# EAGLE design Mixer-01 (EAGLE 6.6.0)
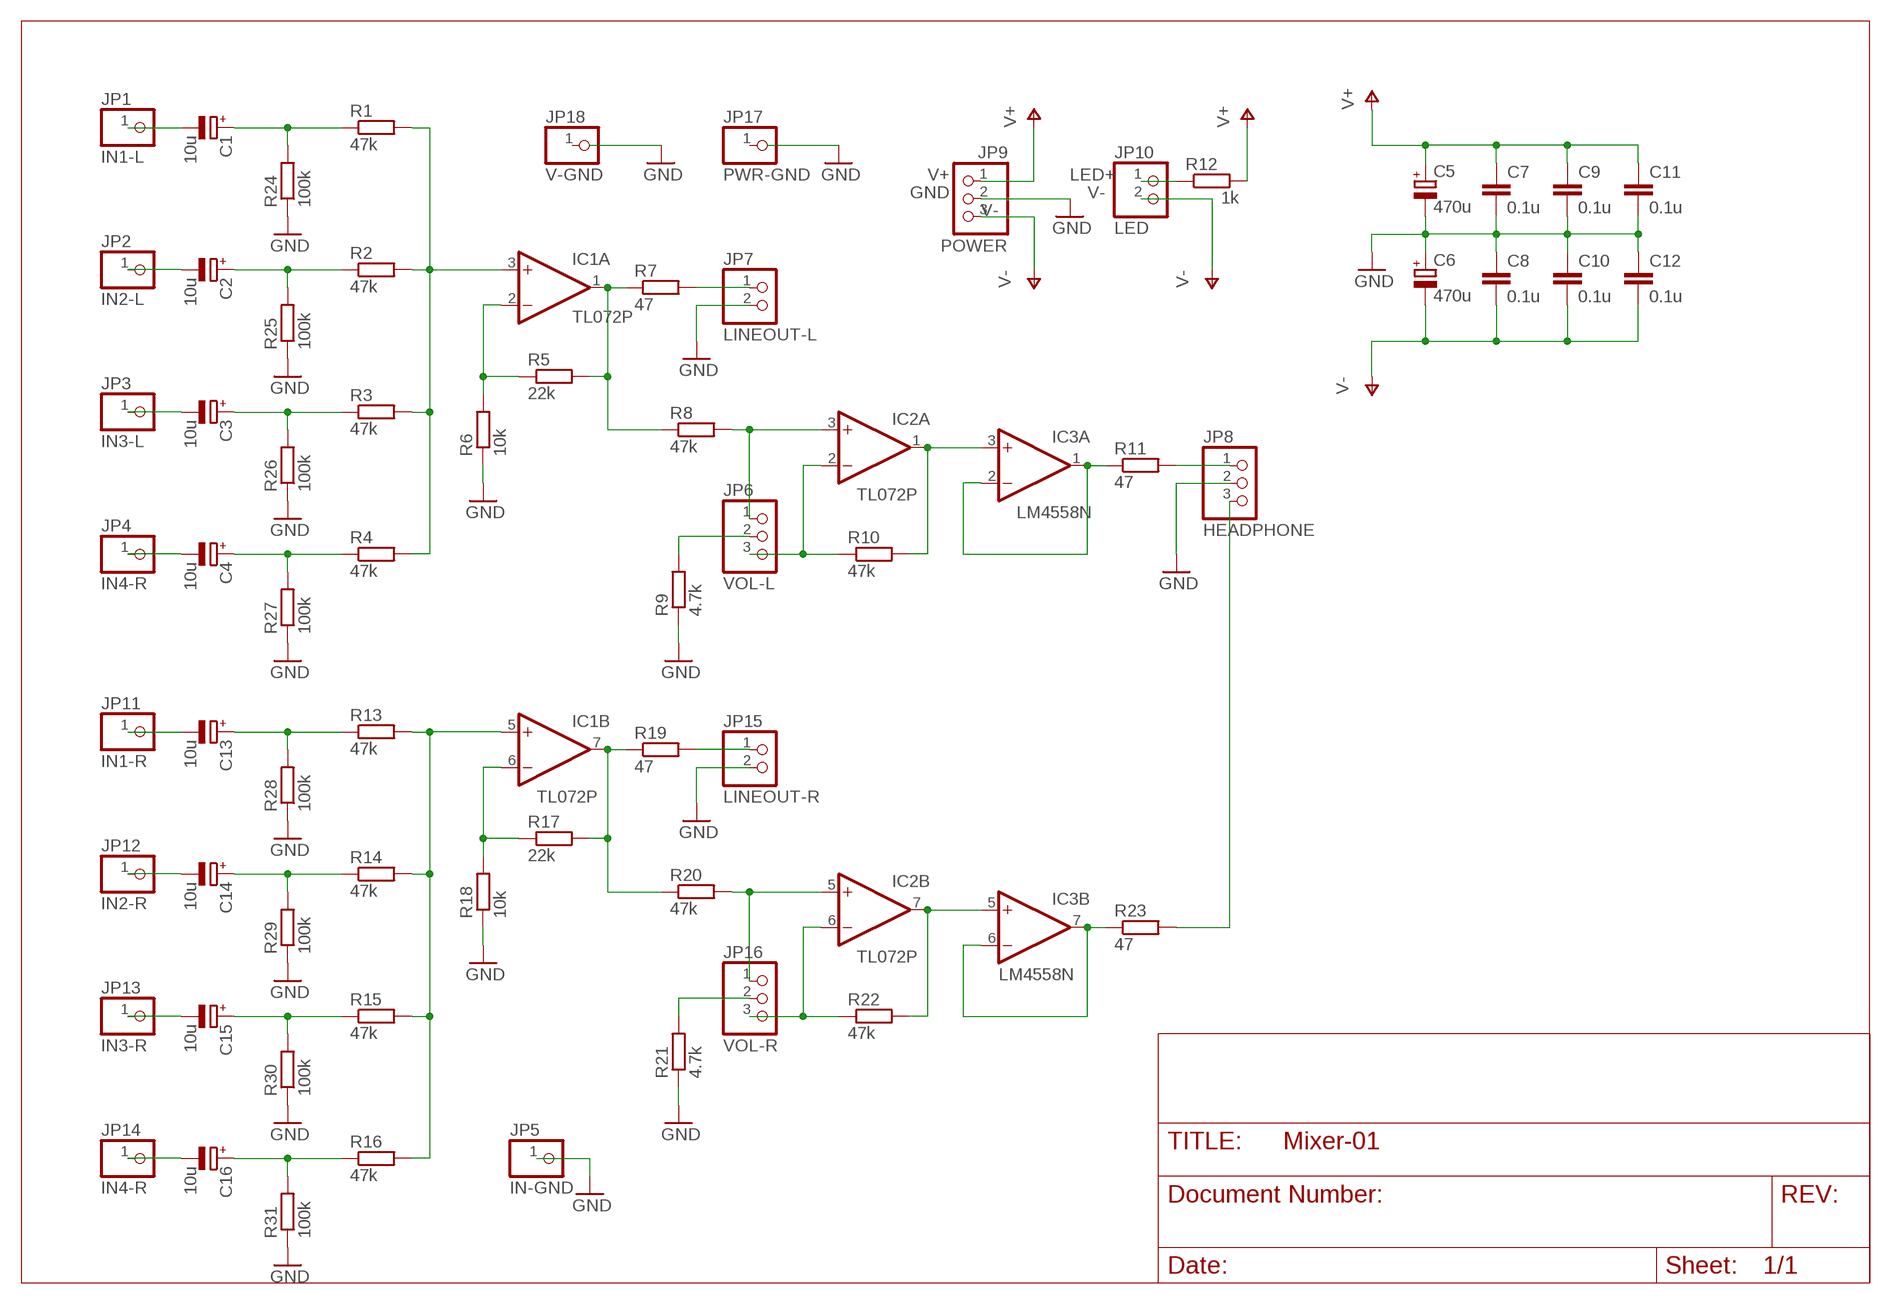
[diagram p0: schematic, sheet 1]

## Parts
C1  10u  CPOL-EUE5-8.5  [E5-8,5]
C2  10u  CPOL-EUE5-8.5  [E5-8,5]
C3  10u  CPOL-EUE5-8.5  [E5-8,5]
C4  10u  CPOL-EUE5-8.5  [E5-8,5]
C5  470u  CPOL-EUE7.5-16  [E7,5-16]
C6  470u  CPOL-EUE7.5-16  [E7,5-16]
C7  0.1u  C-EU050-024X044  [C050-024X044]
C8  0.1u  C-EU050-024X044  [C050-024X044]
C9  0.1u  C-EU050-024X044  [C050-024X044]
C10  0.1u  C-EU050-024X044  [C050-024X044]
C11  0.1u  C-EU050-024X044  [C050-024X044]
C12  0.1u  C-EU050-024X044  [C050-024X044]
C13  10u  CPOL-EUE5-8.5  [E5-8,5]
C14  10u  CPOL-EUE5-8.5  [E5-8,5]
C15  10u  CPOL-EUE5-8.5  [E5-8,5]
C16  10u  CPOL-EUE5-8.5  [E5-8,5]
IC1  TL072P  [DIL08]
IC2  TL072P  [DIL08]
IC3  LM4558N  [DIL08]
JP1  IN1-L  PINHD-1X1  [1X01]
JP2  IN2-L  PINHD-1X1  [1X01]
JP3  IN3-L  PINHD-1X1  [1X01]
JP4  IN4-R  PINHD-1X1  [1X01]
JP5  IN-GND  PINHD-1X1  [1X01]
JP6  VOL-L  PINHD-1X3  [1X03]
JP7  LINEOUT-L  PINHD-1X2  [1X02]
JP8  HEADPHONE  PINHD-1X3  [1X03]
JP9  POWER  PINHD-1X3  [1X03]
JP10  LED  PINHD-1X2  [1X02]
JP11  IN1-R  PINHD-1X1  [1X01]
JP12  IN2-R  PINHD-1X1  [1X01]
JP13  IN3-R  PINHD-1X1  [1X01]
JP14  IN4-R  PINHD-1X1  [1X01]
JP15  LINEOUT-R  PINHD-1X2  [1X02]
JP16  VOL-R  PINHD-1X3  [1X03]
JP17  PWR-GND  PINHD-1X1  [1X01]
JP18  V-GND  PINHD-1X1  [1X01]
R1  47k  R-EU_0207/7  [0207/7]
R2  47k  R-EU_0207/7  [0207/7]
R3  47k  R-EU_0207/7  [0207/7]
R4  47k  R-EU_0207/7  [0207/7]
R5  22k  R-EU_0207/7  [0207/7]
R6  10k  R-EU_0207/7  [0207/7]
R7  47  R-EU_0207/7  [0207/7]
R8  47k  R-EU_0207/7  [0207/7]
R9  4.7k  R-EU_0207/7  [0207/7]
R10  47k  R-EU_0207/7  [0207/7]
R11  47  R-EU_0207/7  [0207/7]
R12  1k  R-EU_0207/7  [0207/7]
R13  47k  R-EU_0207/7  [0207/7]
R14  47k  R-EU_0207/7  [0207/7]
R15  47k  R-EU_0207/7  [0207/7]
R16  47k  R-EU_0207/7  [0207/7]
R17  22k  R-EU_0207/7  [0207/7]
R18  10k  R-EU_0207/7  [0207/7]
R19  47  R-EU_0207/7  [0207/7]
R20  47k  R-EU_0207/7  [0207/7]
R21  4.7k  R-EU_0207/7  [0207/7]
R22  47k  R-EU_0207/7  [0207/7]
R23  47  R-EU_0207/7  [0207/7]
R24  100k  R-EU_0207/7  [0207/7]
R25  100k  R-EU_0207/7  [0207/7]
R26  100k  R-EU_0207/7  [0207/7]
R27  100k  R-EU_0207/7  [0207/7]
R28  100k  R-EU_0207/7  [0207/7]
R29  100k  R-EU_0207/7  [0207/7]
R30  100k  R-EU_0207/7  [0207/7]
R31  100k  R-EU_0207/7  [0207/7]

## Nets
GND: C5.- C6.+ C7.2 C8.1 C9.2 C10.1 C11.2 C12.1 JP5.1 JP7.2 JP8.2 JP9.2 JP15.2 R6.1 R9.1 R18.1 R21.1 R24.1 R25.1 R26.1 R27.1 R28.1 R29.1 R30.1 R31.1
LED+: JP10.1 R12.1
N$1: C1.- JP1.1
N$2: C2.- JP2.1
N$3: C3.- JP3.1
N$4: C4.- JP4.1
N$6: JP6.2 R9.2
N$7: C13.+ R13.1 R28.2
N$8: C14.+ R14.1 R29.2
N$9: C1.+ R1.1 R24.2
N$10: C2.+ R2.1 R25.2
N$11: C3.+ R3.1 R26.2
N$12: C4.+ R4.1 R27.2
N$13: IC1.3(A:+IN) R1.2 R2.2 R3.2 R4.2
N$14: IC1.2(A:-IN) R5.1 R6.2
N$15: IC1.1(A:OUT) R5.2 R7.1 R8.1
N$16: JP7.1 R7.2
N$17: IC2.3(A:+IN) JP6.1 R8.2
N$18: C15.+ R15.1 R30.2
N$19: IC2.2(A:-IN) JP6.3 R10.1
N$20: IC2.1(A:OUT) IC3.3(A:+IN) R10.2
N$21: IC3.1(A:OUT) IC3.2(A:-IN) R11.1
N$22: JP8.1 R11.2
N$23: C16.+ R16.1 R31.2
N$24: IC1.5(B:+IN) R13.2 R14.2 R15.2 R16.2
N$25: IC1.6(B:-IN) R17.1 R18.2
N$26: IC1.7(B:OUT) R17.2 R19.1 R20.1
N$27: JP15.1 R19.2
N$28: IC2.5(B:+IN) JP16.1 R20.2
N$29: IC2.6(B:-IN) JP16.3 R22.1
N$30: IC2.7(B:OUT) IC3.5(B:+IN) R22.2
N$31: IC3.6(B:-IN) IC3.7(B:OUT) R23.1
N$32: JP8.3 R23.2
N$33: C13.- JP11.1
N$34: C14.- JP12.1
N$35: C15.- JP13.1
N$36: C16.- JP14.1
N$37: JP16.2 R21.2
V+: C5.+ C7.1 C9.1 C11.1 JP9.1 R12.2
V-: C6.- C8.2 C10.2 C12.2 JP9.3 JP10.2
Unconnected: JP17.1 JP18.1

## Power pins joined to a net without a drawn wire
V+: IC1.8(P:V+) IC2.8(P:V+) IC3.8(P:V+)
V-: IC1.4(P:V-) IC2.4(P:V-) IC3.4(P:V-)

## Library data of the parts
C1-C6 C13-C16 = rcl:CPOL-EU: POLARIZED CAPACITOR, European symbol
C7-C12 = resistor:C-EU: CAPACITOR, European symbol
IC1 IC2 = linear:TL072: OP AMP
IC3 = linear:*4558: OP AMP
JP1-JP5 JP11-JP14 JP17 JP18 = pinhead:PINHD-1X1: PIN HEADER
JP6 JP8 JP9 JP16 = pinhead:PINHD-1X3: PIN HEADER
JP7 JP10 JP15 = pinhead:PINHD-1X2: PIN HEADER
R1-R23 = resistor:R-EU_: RESISTOR, European symbol
R24-R31 = rcl:R-EU_: RESISTOR, European symbol

## Board
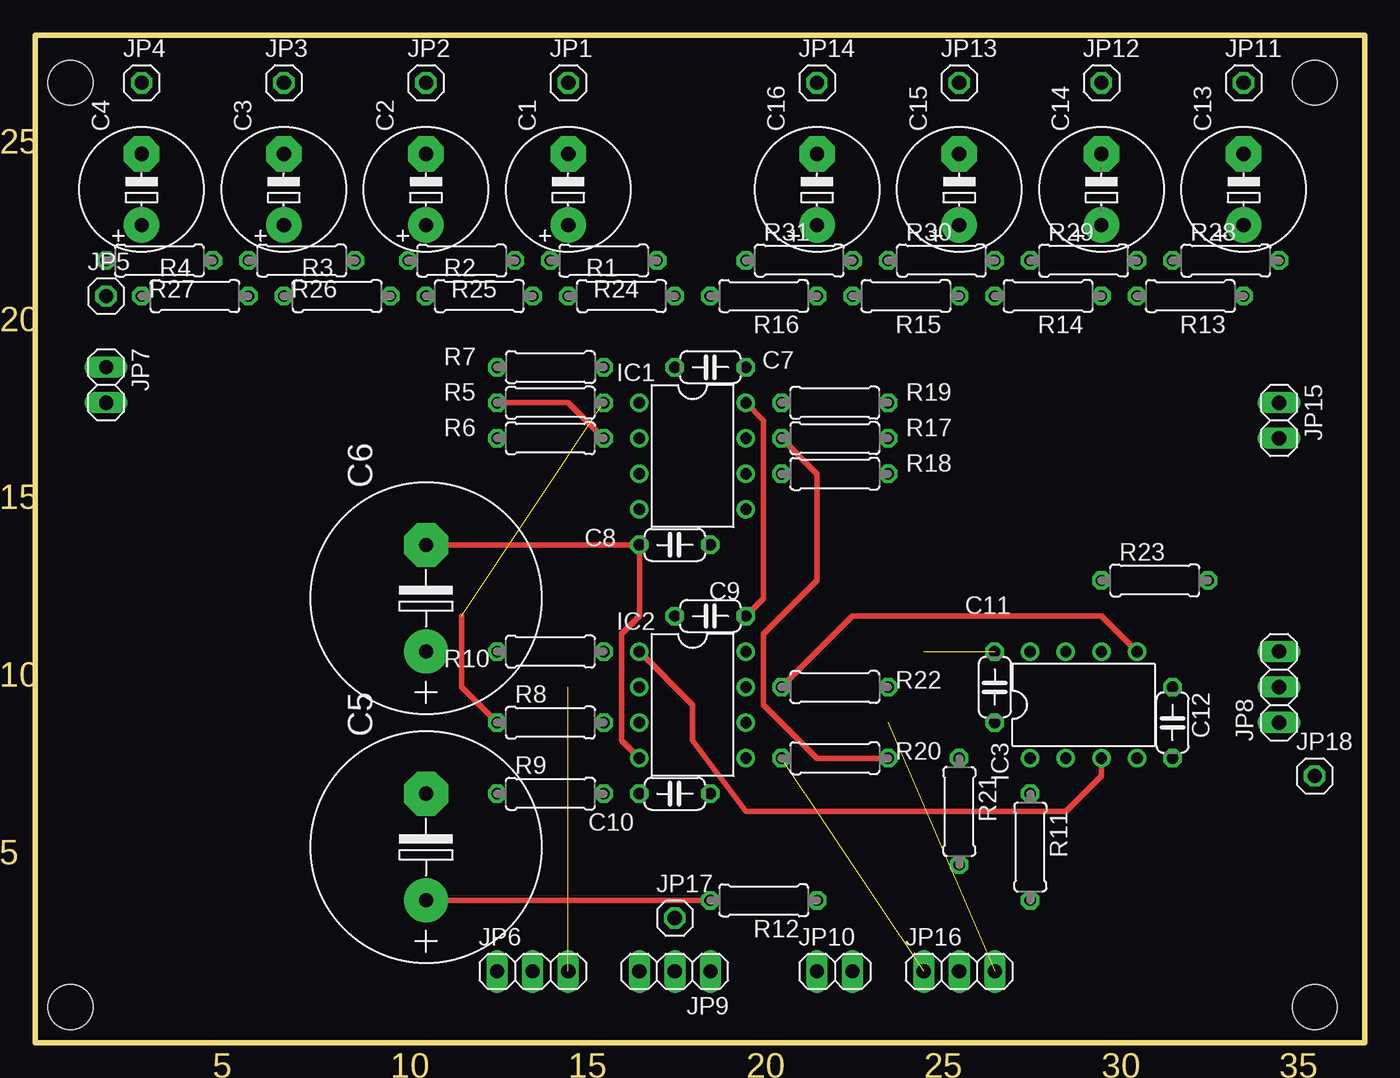
[diagram p1: board, top side]
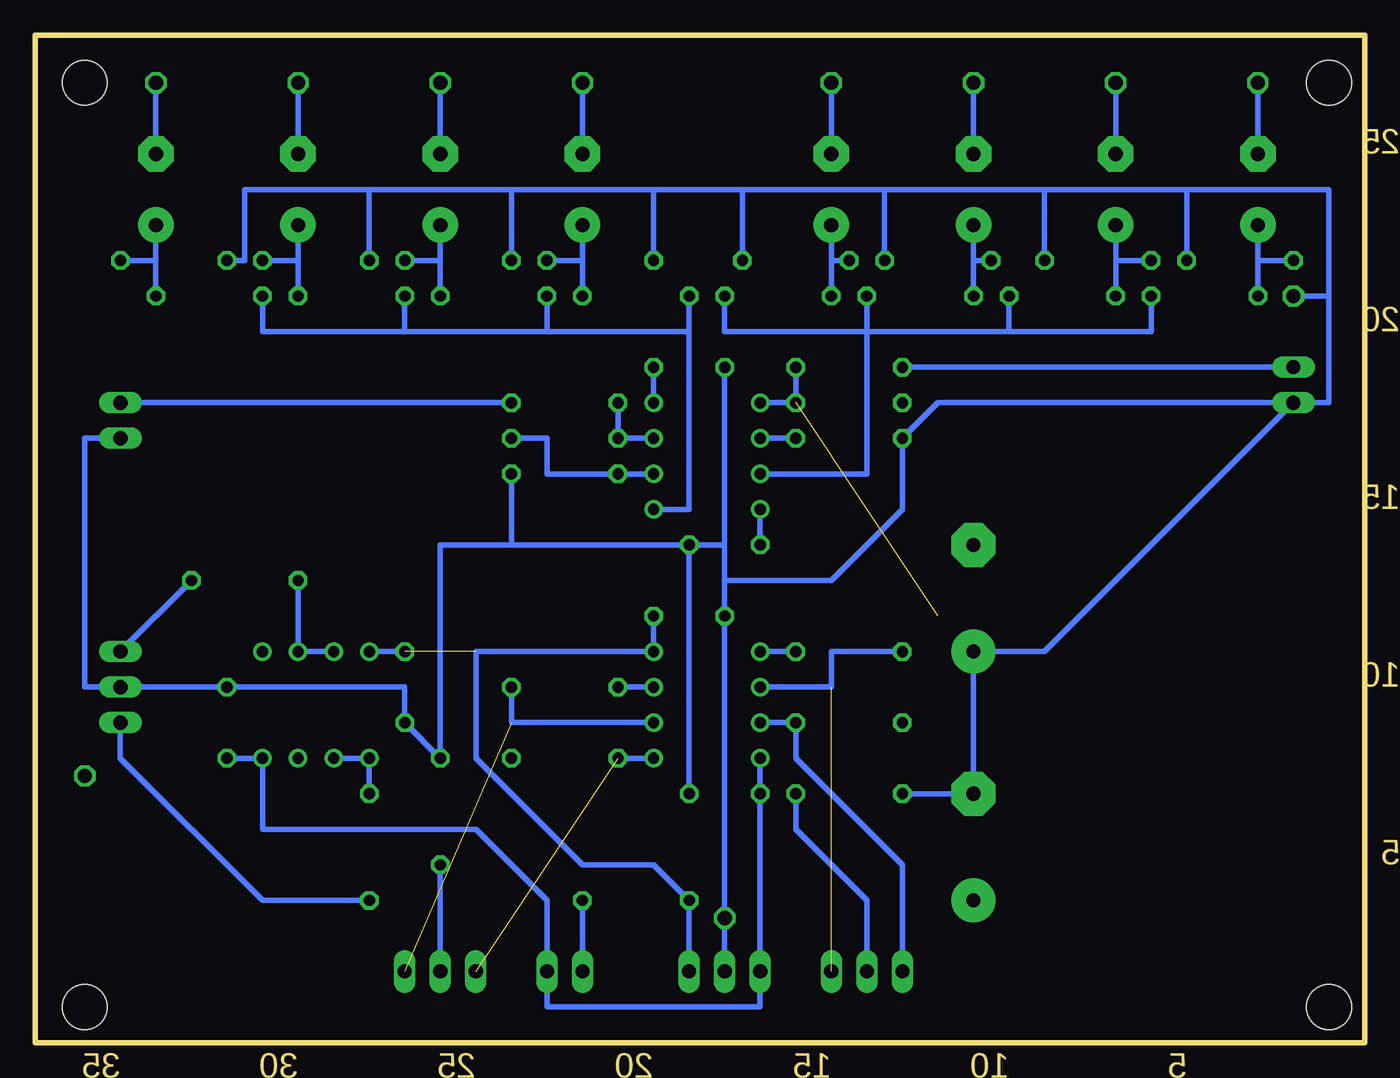
[diagram p2: board, bottom side, seen from below]

Size 95 x 72 mm. Coordinates in mm from the lower left corner, seen from the top.
Outline: 0,0 0,72 95,72 95,0 0,0
Copper layers (1*16): Top 0.035mm / dielectric 1.5mm / Bottom 0.035mm
Design rules "default": minimum track width 10mil, minimum drill 24mil, track to track 8mil, track to pad 8mil, pad to pad 8mil, via to via 8mil, smd to smd 8mil, copper to edge 40mil, drill to drill 8mil, minimum pad ring 10mil, minimum via ring 8mil, stop-mask expansion 4mil, vias tented up to drill 0mil, thermal gap 10mil
Holes 3.2 mm at 2.54,68.58 2.54,2.54 91.44,2.54 91.44,68.58

### Footprints (pad centres in the part's own frame; a part is rotated, then mirrored left to right if it is on the bottom)
E5-8,5 = drill 1.016 pad 2.54: + -2.54,0 | drill 1.016 pad 2.54 octagon: - 2.54,0
E7,5-16 = drill 1.016 pad 3.15: + -3.81,0 | drill 1.016 pad 3.15 octagon: - 3.81,0
C050-024X044 = drill 0.813 octagon: 1 -2.54,0; 2 2.54,0
DIL08 = drill 0.813 pad 1.27: 1 -3.81,-3.81; 2 -1.27,-3.81; 3 1.27,-3.81; 4 3.81,-3.81; 5 3.81,3.81; 6 1.27,3.81; 7 -1.27,3.81; 8 -3.81,3.81
1X01 = drill 1.016 octagon: 1 0,0
1X03 = drill 1.016 long: 1 -2.54,0; 2 0,0; 3 2.54,0
1X02 = drill 1.016 long: 1 -1.27,0; 2 1.27,0
0207/7 = drill 0.813 octagon: 1 -3.81,0; 2 3.81,0

### Placement (x,y rotation side)
C1  38.1,60.96 90 top
C2  27.94,60.96 90 top
C3  17.78,60.96 90 top
C4  7.62,60.96 90 top
C5  27.94,13.97 90 top
C6  27.94,31.75 90 top
C7  48.26,48.26 180 top
C8  45.72,35.56 180 top
C9  48.26,30.48 180 top
C10  45.72,17.78 180 top
C11  68.58,25.4 270 top
C12  81.28,22.86 270 top
C13  86.36,60.96 90 top
C14  76.2,60.96 90 top
C15  66.04,60.96 90 top
C16  55.88,60.96 90 top
IC1  46.99,41.91 270 top
IC2  46.99,24.13 270 top
IC3  74.93,24.13 0 top
JP1  38.1,68.58 0 top
JP2  27.94,68.58 0 top
JP3  17.78,68.58 0 top
JP4  7.62,68.58 0 top
JP5  5.08,53.34 0 top
JP6  35.56,5.08 0 top
JP7  5.08,46.99 270 top
JP8  88.9,25.4 90 top
JP9  45.72,5.08 180 top
JP10  57.15,5.08 0 top
JP11  86.36,68.58 0 top
JP12  76.2,68.58 0 top
JP13  66.04,68.58 0 top
JP14  55.88,68.58 0 top
JP15  88.9,44.45 270 top
JP16  66.04,5.08 0 top
JP17  45.72,8.89 0 top
JP18  91.44,19.05 0 top
R1  41.91,53.34 0 top
R2  31.75,53.34 0 top
R3  21.59,53.34 0 top
R4  11.43,53.34 0 top
R5  36.83,45.72 0 top
R6  36.83,43.18 0 top
R7  36.83,48.26 180 top
R8  36.83,22.86 0 top
R9  36.83,17.78 0 top
R10  36.83,27.94 0 top
R11  71.12,13.97 270 top
R12  52.07,10.16 180 top
R13  82.55,53.34 180 top
R14  72.39,53.34 180 top
R15  62.23,53.34 180 top
R16  52.07,53.34 180 top
R17  57.15,43.18 180 top
R18  57.15,40.64 180 top
R19  57.15,45.72 0 top
R20  57.15,20.32 180 top
R21  66.04,16.51 270 top
R22  57.15,25.4 180 top
R23  80.01,33.02 0 top
R24  40.64,55.88 180 top
R25  30.48,55.88 180 top
R26  19.05,55.88 180 top
R27  8.89,55.88 180 top
R28  85.09,55.88 0 top
R29  74.93,55.88 0 top
R30  64.77,55.88 0 top
R31  54.61,55.88 0 top

### Tracks (layer width: path | path; a pad name or v marks a point on that pad's centre or on a via)
GND
  Bottom 0.406: C7.2 45.72,35.56 | C8.1 C10.1 | JP9.2 C9.2 45.72,33.02 | 60.96,35.56 66.04,35.56 R21.1 C11.2 68.58,25.4 C12.1 JP8.2 91.44,25.4 91.44,43.18 JP15.2 | 60.96,35.56 C8.1 | R18.1 60.96,35.56 | R9.1 C5.- C6.+ 22.86,27.94 JP7.2 | 45.72,33.02 45.72,35.56 | C8.1 45.72,35.56 | 2.54,53.34 2.54,45.72 JP7.2 | 10.16,45.72 JP7.2 | JP7.2 30.48,45.72 R6.1 33.02,38.1 38.1,33.02 45.72,33.02 | JP5.1 2.54,53.34 | 2.54,53.34 2.54,60.96 12.7,60.96 | 12.7,60.96 R27.1 | R26.1 22.86,60.96 | 22.86,60.96 12.7,60.96 | R25.1 34.29,60.96 | 34.29,60.96 22.86,60.96 | R24.1 44.45,60.96 | 44.45,60.96 34.29,60.96 | R31.1 50.8,60.96 | 50.8,60.96 44.45,60.96 | R30.1 60.96,60.96 | 60.96,60.96 50.8,60.96 | R28.1 80.01,55.88 80.01,60.96 71.12,60.96 | 71.12,60.96 60.96,60.96 | R29.1 71.12,60.96
LED+
  Bottom 0.406: R12.1 JP10.1
N$1
  Bottom 0.406: C1.- JP1.1
N$2
  Bottom 0.406: C2.- JP2.1
N$3
  Bottom 0.406: C3.- JP3.1
N$4
  Bottom 0.406: C4.- JP4.1
N$6
  Bottom 0.406: R9.2 40.64,15.24 35.56,10.16 JP6.2
N$7
  Bottom 0.406: C13.+ 86.36,55.88 | 86.36,55.88 R13.1 | R28.2 86.36,55.88
N$8
  Bottom 0.406: R14.1 76.2,55.88 | 76.2,55.88 C14.+ | R29.2 76.2,55.88
N$9
  Bottom 0.406: C1.+ 38.1,55.88 | 38.1,55.88 R1.1 | R24.2 38.1,55.88
N$10
  Bottom 0.406: C2.+ 27.94,55.88 | 27.94,55.88 R2.1 | R25.2 27.94,55.88
N$11
  Bottom 0.406: C3.+ 17.78,55.88 | 17.78,55.88 R3.1 | R26.2 17.78,55.88
N$12
  Bottom 0.406: C4.+ 7.62,55.88 | 7.62,55.88 R4.1 | R27.2 7.62,55.88
N$13
  Bottom 0.406: IC1.3 35.56,40.64 35.56,50.8 | R4.2 15.24,50.8 25.4,50.8 | 25.4,50.8 35.56,50.8 | R3.2 25.4,50.8 | R2.2 35.56,50.8 | 35.56,50.8 45.72,50.8 R1.2
N$14
  Top 0.406: R5.1 38.1,45.72 R6.2
  Bottom 0.406: IC1.2 R6.2
N$15  (1 unrouted)
  Top 0.406: 30.48,30.48 30.48,25.4 R8.1
  Bottom 0.406: IC1.1 R5.2 R7.1
N$16
  Bottom 0.406: JP7.1 R7.2
N$17
  Bottom 0.406: IC2.3 R8.2 40.64,20.32 33.02,12.7 JP6.1
N$18
  Bottom 0.406: C15.+ 66.04,55.88 | 66.04,55.88 R15.1 | R30.2 66.04,55.88
N$19  (1 unrouted)
  Bottom 0.406: R10.1 38.1,27.94 38.1,25.4 IC2.2
N$20
  Top 0.406: IC3.3 76.2,19.05 73.66,16.51 50.8,16.51 46.99,21.59 46.99,24.13 IC2.1
  Bottom 0.406: R10.2 IC2.1
N$21
  Bottom 0.406: IC3.2 IC3.1 R11.1
N$22
  Bottom 0.406: R11.2 78.74,10.16 88.9,20.32 JP8.1
N$23
  Bottom 0.406: C16.+ 55.88,55.88 | 55.88,55.88 R16.1 | R31.2 55.88,55.88
N$24
  Bottom 0.406: R16.2 48.26,50.8 | 48.26,50.8 48.26,38.1 IC1.5 | R15.2 58.42,50.8 | 58.42,50.8 48.26,50.8 | R14.2 68.58,50.8 | 68.58,50.8 58.42,50.8 | R13.2 78.74,50.8 68.58,50.8
N$25
  Bottom 0.406: IC1.6 R18.2 58.42,40.64 58.42,43.18 R17.1
N$26
  Top 0.406: R17.2 55.88,40.64 55.88,33.02 52.07,29.21 52.07,24.13 55.88,20.32 R20.1
  Bottom 0.406: R19.1 R17.2 IC1.7
N$27
  Bottom 0.406: R19.2 JP15.1 90.17,45.72
N$28  (1 unrouted)
  Bottom 0.406: IC2.5 R20.2
N$29  (1 unrouted)
  Bottom 0.406: IC2.6 60.96,22.86 R22.1
N$30
  Top 0.406: IC3.5 76.2,30.48 58.42,30.48 R22.2
  Bottom 0.406: IC2.7 R22.2
N$31
  Bottom 0.406: R23.1 IC3.6 IC3.7
N$32
  Bottom 0.406: R23.2 JP8.3
N$33
  Bottom 0.406: C13.- JP11.1
N$34
  Bottom 0.406: C14.- JP12.1
N$35
  Bottom 0.406: C15.- JP13.1
N$36
  Bottom 0.406: C16.- JP14.1
N$37
  Bottom 0.406: JP16.2 R21.2
V+  (1 unrouted)
  Top 0.406: C5.+ R12.2 | IC1.8 52.07,44.45 52.07,31.75 C9.1
  Bottom 0.406: C9.1 IC2.8 63.5,27.94 63.5,20.32 55.88,12.7 50.8,12.7 R12.2 JP9.1 | C7.1 IC1.8 | IC3.8 C11.1
V-
  Top 0.406: IC2.4 41.91,21.59 41.91,29.21 43.18,30.48 C8.2 C6.-
  Bottom 0.406: IC2.4 C10.2 JP9.3 43.18,2.54 58.42,2.54 JP10.2 58.42,10.16 63.5,15.24 78.74,15.24 IC3.4 C12.2 | C8.2 IC1.4

### Text on the board
Dimension: 25 | 20 | 15 | 10 | 5 | 5 | 10 | 15 | 20 | 25 | 30 | 35